# EAGLE schematic smps v.1.3 (EAGLE 7.3.0)
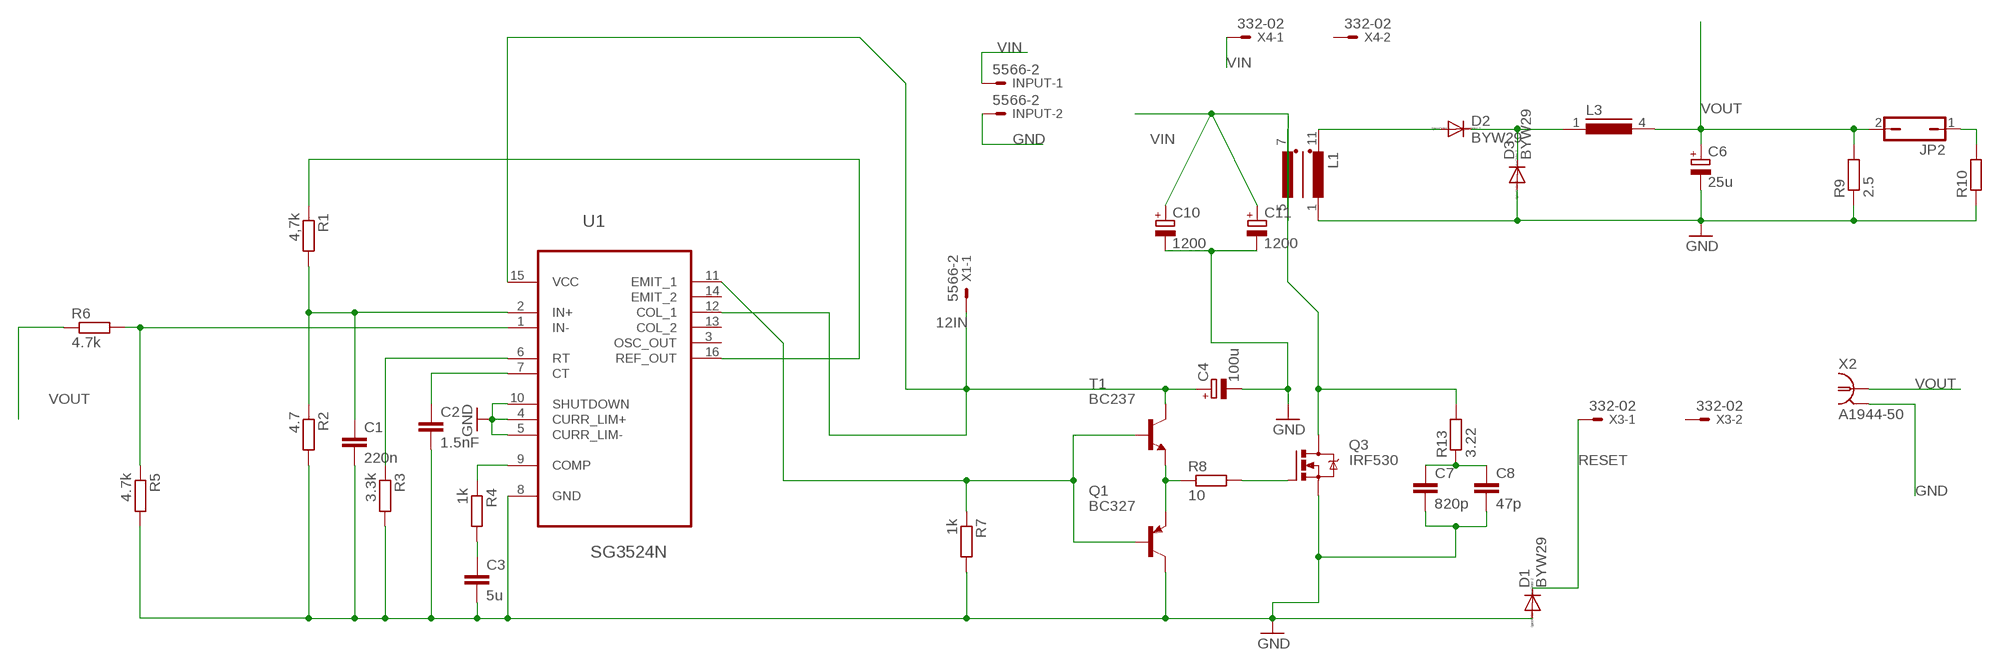
[diagram p0: schematic, sheet 1]

## Parts
C1  220n  C-EU050-030X075  [C050-030X075]
C2  1.5nF  C-EU050-035X075  [C050-035X075]
C3  5u  C-EU050-035X075  [C050-035X075]
C4  100u  CPOL-EUE3.5-8  [E3,5-8]
C6  25u  CPOL-EUE3.5-8  [E3,5-8]
C7  820p  C-EU050-030X075  [C050-030X075]
C8  47p  C-EU050-030X075  [C050-030X075]
C10  1200  CPOL-EUE7.5-16  [E7,5-16]
C11  1200  CPOL-EUE7.5-16  [E7,5-16]
D1  BYW29  [DO220S]
D2  BYW29  [DO220S]
D3  BYW29  [DO220S]
INPUT  5566-2  [5566-2]
JP2  JP1Q  [JP1]
L1  RM6-2RM812  [RM8-12]
L3  RM6NEWVARIANT  [RM7-8]
Q1  BC327  [TO92]
Q3  IRF530  [TO220BV]
R1  4,7k  R-EU_0204/7  [0204/7]
R2  4.7  R-EU_0204/7  [0204/7]
R3  3.3k  R-EU_0204/7  [0204/7]
R4  1k  R-EU_0204/7  [0204/7]
R5  4.7k  R-EU_0204/7  [0204/7]
R6  4.7k  R-EU_0204/7  [0204/7]
R7  1k  R-EU_0204/7  [0204/7]
R8  10  R-EU_0204/7  [0204/7]
R9  2.5  R-EU_0617/5V  [0617V]
R10  R-EU_0617/5V  [0617V]
R13  3.22  R-EU_0204/2V  [0204V]
T1  BC237  [TO92]
U1  SG3524N  [DIP254P762X508-16]
X1  5566-2  [5566-2]
X2  A1944-50  [A1944]
X3  332-02  [332-02]
X4  332-02  [332-02]

## Nets
12IN: C4.+ T1.3(C) U1.12(COL_1) U1.15(VCC) X1.1
GND: C1.2 C2.2 C3.2 C4.- C6.- C7.2 C8.2 C10.- C11.- D1.A D3.A INPUT.2 L1.1(W1E) Q1.3(C) Q3.S R2.2 R3.2 R5.2 R7.2 R9.1 R10.1 U1.4(CURR_LIM+) U1.5(CURR_LIM-) U1.8(GND) U1.10(SHUTDOWN) X2.2 X2.3 X2.4 X2.5
N$1: R1.1 U1.16(REF_OUT)
N$2: C1.1 R1.2 R2.1 U1.2(IN+)
N$3: Q1.2(B) R7.1 T1.2(B) U1.11(EMIT_1)
N$5: R3.1 U1.6(RT)
N$6: C2.1 U1.7(CT)
N$7: R4.1 U1.9(COMP)
N$8: C3.1 R4.2
N$9: R5.1 R6.2 U1.1(IN-)
N$10: Q1.1(E) R8.1 T1.1(E)
N$11: D2.A L1.11(W1A)
N$12: Q3.G R8.2
N$13: D2.C D3.C L3.1
N$14: L1.7(W2A) Q3.D R13.2
N$15: JP2.1 R10.2
N$18: C7.1 C8.1 R13.1
RESET: D1.C X3.1
VIN: C10.+ C11.+ INPUT.1 L1.5(W2E) X4.1
VOUT: C6.+ JP2.2 L3.4 R6.1 R9.2 X2.1
Unconnected: U1.3(OSC_OUT) U1.13(COL_2) U1.14(EMIT_2) X1.2 X3.2 X4.2

## Library data of the parts
C1 = resistor:C-EU: CAPACITOR, European symbol
C2 C3 C7 C8 = rcl:C-EU: CAPACITOR, European symbol
C4 C6 C10 C11 = rcl:CPOL-EU: POLARIZED CAPACITOR, European symbol
D1-D3 = diode:BYW29: DIODE ultra fast rectifier, 200 V, 8 A
INPUT X1 = con-molex:5566-2: Mini FIT connector 2 pol Source: http://www.molex.com; OC_FARNELL: 1822072; OC_NEWARK: unknown
JP2 = jumper:JP1Q: JUMPER
L1 = trafo-siemens:RM6-2: TRANSFORMER
L3 = trafo-siemens:RM6: INDUCTOR
Q1 = transistor-pnp:BC327: PNP Transistor
Q3 = transistor-power:IRF530: HEXFET Power MOSFET
R1-R8 = resistor:R-EU_: RESISTOR, European symbol
R9 R10 R13 = rcl:R-EU_: RESISTOR, European symbol
T1 = transistor:BC237: NPN TRANSISTOR
U1 = Texas Instruments_By_element14_Batch_1:SG3524N: REGULATING PULSE-WIDTH-MODULATORS; MPN: SG3524N; OC_FARNELL: 1094322; OC_NEWARK: 60K6778; PACKAGE: PDIP-16; SUPPLIER: Texas Instruments
X2 = con-coax:A1944-50: BNC CONNECTOR 50 Ohm distributor Buerklin 78F2475; OC_FARNELL: unknown; OC_NEWARK: unknown
X3 X4 = con-garry:332-02: 2 Pin - 2mm Dual Row Source: www.mpe-connector.de / garry_shortform_2012.pdf